# Altium project ALCT_MEZ_LX100.PrjPcb (part 5 of 8)

## Sheet GBTx_IO.SchDoc: GBTx I/O
size B; Organization: UCLA High Energy Physics; Address1: L3, 12a Rodborough Rd; Address2: Frenchs Forest; Address3: NSW; Address4: Australia 2086; DocumentNumber: 15; Revision: 2.0; SheetNumber: 15; SheetTotal: 23; CurrentDate: 9/6/2018; ModifiedDate: 9/6/2018; ProjectName: Project
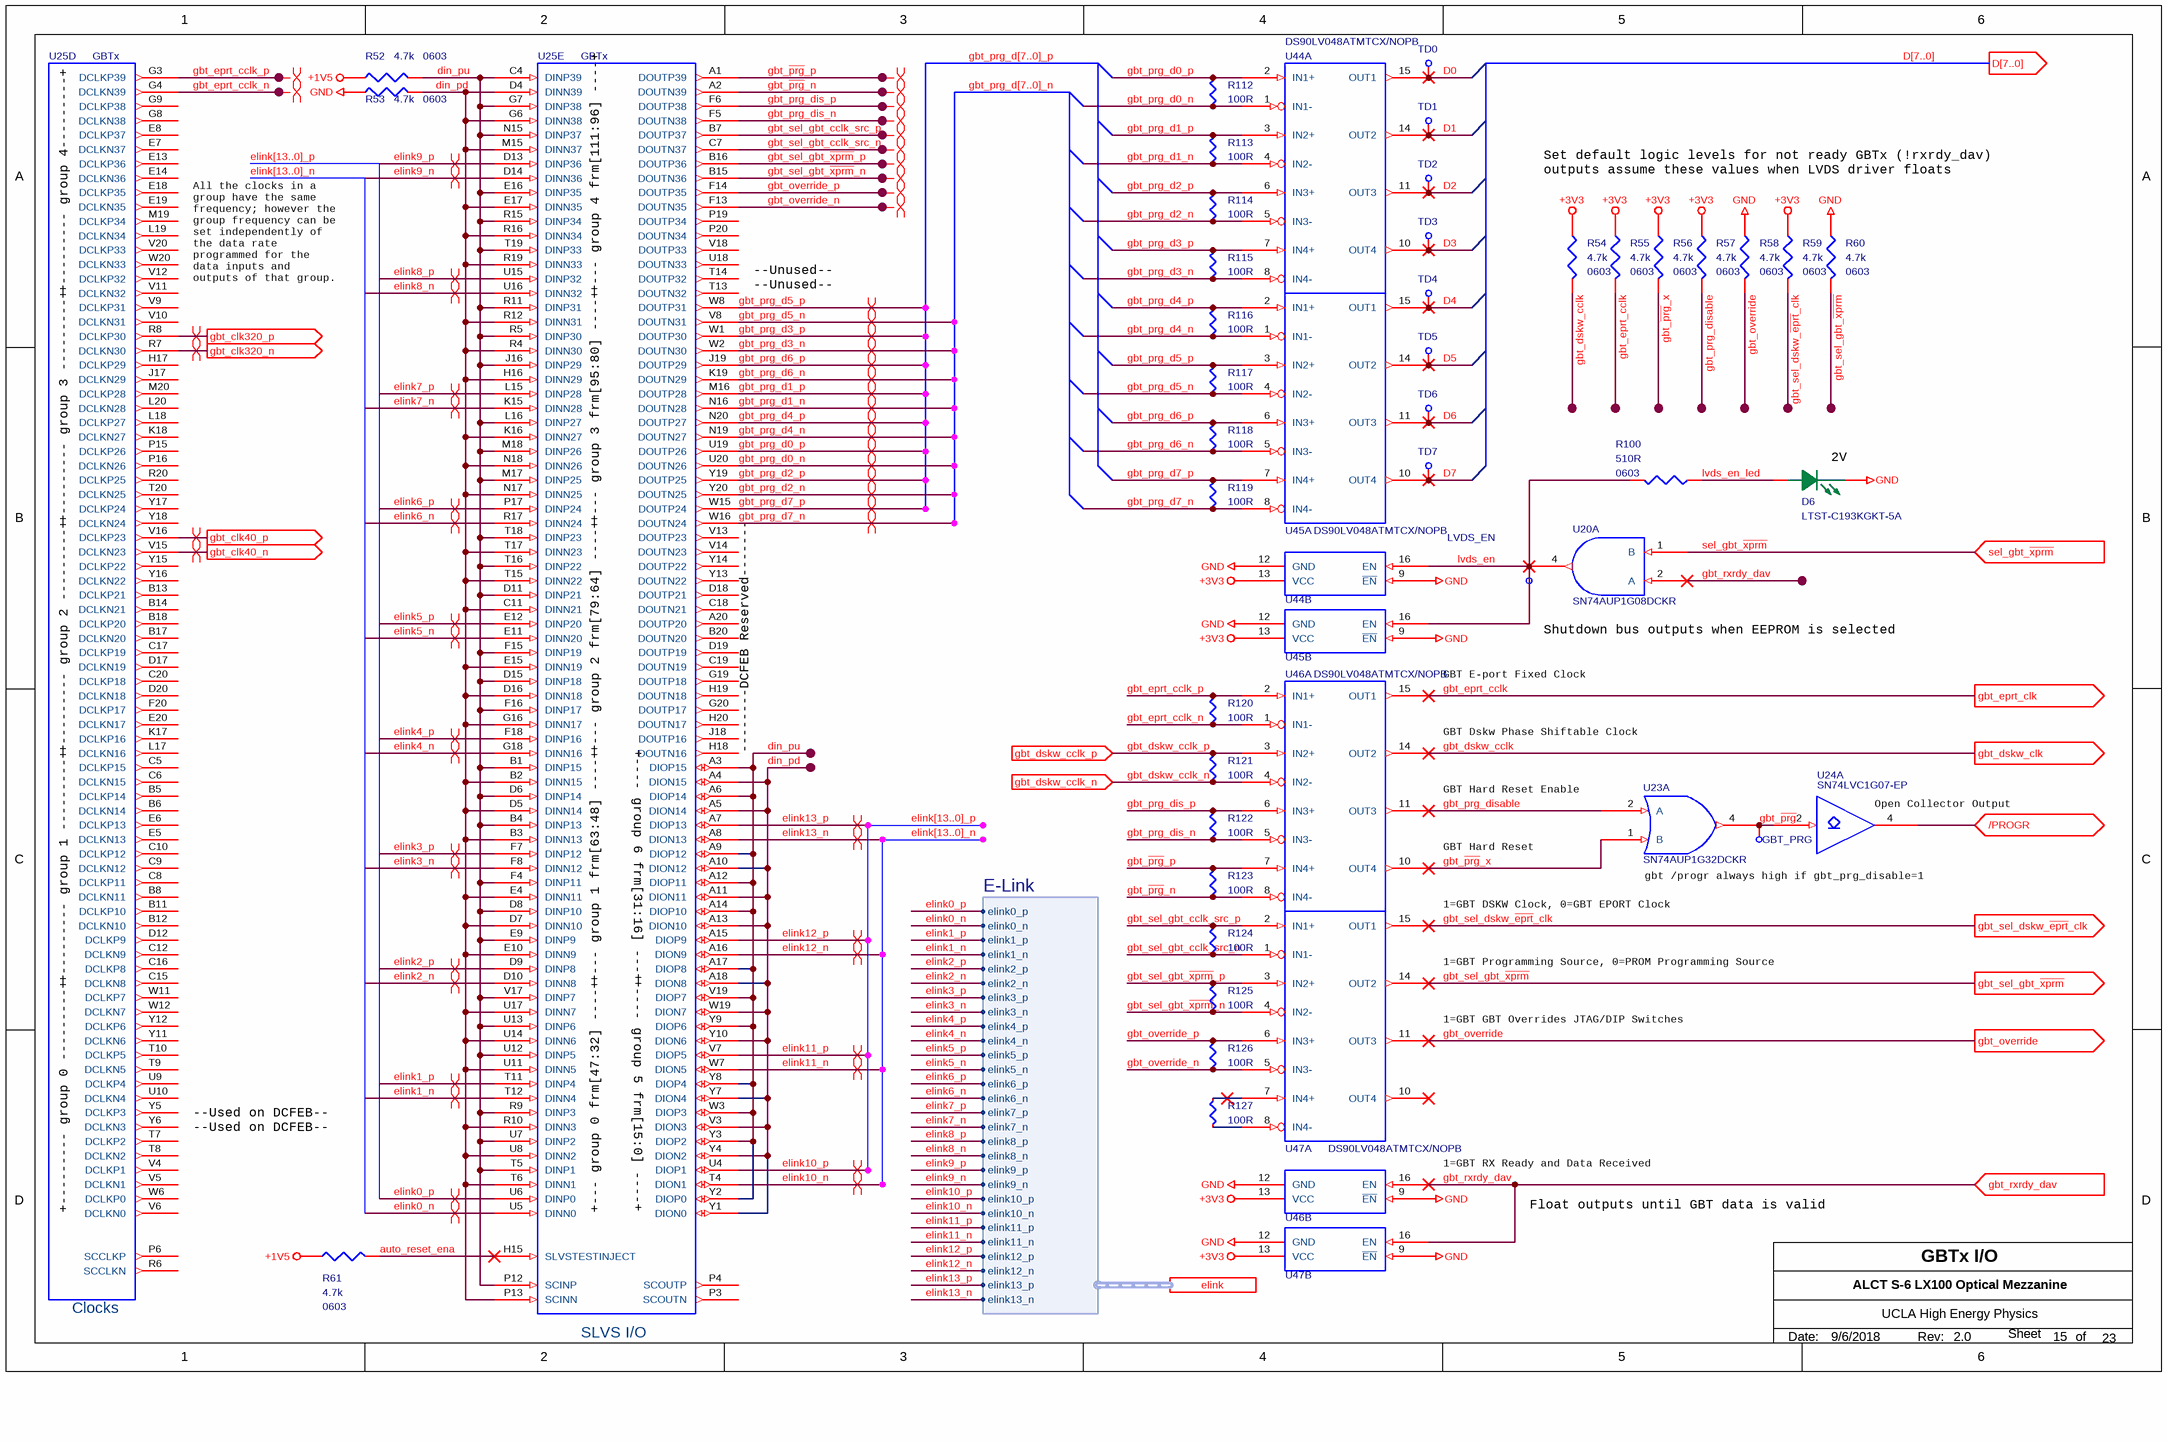
[diagram p19: GBTx_IO.SchDoc]

### Parts
D6  LTST-C193KGKT-5A  [MC_S6/SM/LED_0603]
GBT_PRG  Test Point Via  [MC_S6/TH/TPVIA]  (value not drawn)  (no BOM)
LVDS_EN  Test Point Via  [MC_S6/TH/TPVIA]  (value not drawn)  (no BOM)
R52  4.7k  Supplier Device Package: 0603  [MC_S6/SM/R_0603_IPC]
R53  4.7k  Supplier Device Package: 0603  [MC_S6/SM/R_0603_IPC]
R54  4.7k  Supplier Device Package: 0603  [MC_S6/SM/R_0603_IPC]
R55  4.7k  Supplier Device Package: 0603  [MC_S6/SM/R_0603_IPC]
R56  4.7k  Supplier Device Package: 0603  [MC_S6/SM/R_0603_IPC]
R57  4.7k  Supplier Device Package: 0603  [MC_S6/SM/R_0603_IPC]
R58  4.7k  Supplier Device Package: 0603  [MC_S6/SM/R_0603_IPC]
R59  4.7k  Supplier Device Package: 0603  [MC_S6/SM/R_0603_IPC]
R60  4.7k  Supplier Device Package: 0603  [MC_S6/SM/R_0603_IPC]
R61  4.7k  Supplier Device Package: 0603  [MC_S6/SM/R_0603_IPC]
R100  510R  Supplier Device Package: 0603  [MC_S6/SM/R_0603_IPC]
R112  100R  [MC_S6/SM/R_0402_IPC]
R113  100R  [MC_S6/SM/R_0402_IPC]
R114  100R  [MC_S6/SM/R_0402_IPC]
R115  100R  [MC_S6/SM/R_0402_IPC]
R116  100R  [MC_S6/SM/R_0402_IPC]
R117  100R  [MC_S6/SM/R_0402_IPC]
R118  100R  [MC_S6/SM/R_0402_IPC]
R119  100R  [MC_S6/SM/R_0402_IPC]
R120  100R  [MC_S6/SM/R_0402_IPC]
R121  100R  [MC_S6/SM/R_0402_IPC]
R122  100R  [MC_S6/SM/R_0402_IPC]
R123  100R  [MC_S6/SM/R_0402_IPC]
R124  100R  [MC_S6/SM/R_0402_IPC]
R125  100R  [MC_S6/SM/R_0402_IPC]
R126  100R  [MC_S6/SM/R_0402_IPC]
R127  100R  [MC_S6/SM/R_0402_IPC]
TD0  Test Point Via  [MC_S6/TH/TPVIA]  (value not drawn)  (no BOM)
TD1  Test Point Via  [MC_S6/TH/TPVIA]  (value not drawn)  (no BOM)
TD2  Test Point Via  [MC_S6/TH/TPVIA]  (value not drawn)  (no BOM)
TD3  Test Point Via  [MC_S6/TH/TPVIA]  (value not drawn)  (no BOM)
TD4  Test Point Via  [MC_S6/TH/TPVIA]  (value not drawn)  (no BOM)
TD5  Test Point Via  [MC_S6/TH/TPVIA]  (value not drawn)  (no BOM)
TD6  Test Point Via  [MC_S6/TH/TPVIA]  (value not drawn)  (no BOM)
TD7  Test Point Via  [MC_S6/TH/TPVIA]  (value not drawn)  (no BOM)
U20  SN74AUP1G08DCKR  [MC_S6/SM/SOT_SC70_DCK5]  (part A of 2)
U23  SN74AUP1G32DCKR  [MC_S6/SM/SOT_SC70_DCK5]  (part A of 2)
U24  SN74LVC1G07-EP  [SOT353-1]  (part A of 2)
U25  GBTx  [BGA400 GBT]  (parts D,E of 8)
U44  DS90LV048ATMTCX/NOPB  [MC_S6/SM/TSSOP16]  (parts A,B of 2)
U45  DS90LV048ATMTCX/NOPB  [MC_S6/SM/TSSOP16]  (parts A,B of 2)
U46  DS90LV048ATMTCX/NOPB  [MC_S6/SM/TSSOP16]  (parts A,B of 2)
U47  DS90LV048ATMTCX/NOPB  [MC_S6/SM/TSSOP16]  (parts A,B of 2)

### Ports
/PROGR (bidir), D[7..0] (out), elink (harness E-Link), gbt_clk40_n (out), gbt_clk40_p (out), gbt_clk320_n (out), gbt_clk320_p (out), gbt_dskw_cclk_n (in), gbt_dskw_cclk_p (in), gbt_dskw_clk (out), gbt_eprt_clk (out), gbt_override (out), gbt_rxrdy_dav (in), gbt_sel_dskw_~{eprt}_clk (out), gbt_sel_gbt_~{xprm} (out), sel_gbt_~{xprm} (in)

### Harnesses
E-Link: elink0_p, elink0_n, elink1_p, elink1_n, elink2_p, elink2_n, elink3_p, elink3_n, elink4_p, elink4_n, elink5_p, elink5_n, elink6_p, elink6_n, elink7_p, elink7_n, elink8_p, elink8_n, elink9_p, elink9_n, elink10_p, elink10_n, elink11_p, elink11_n, elink12_p, elink12_n, elink13_p, elink13_n

### Nets
+1V5: R52.1 R61.1
+3V3: R54.1 R55.1 R56.1 R57.1 R59.1 U44.13(VCC) U45.13(VCC) U46.13(VCC) U47.13(VCC)
GND: D6.K(CATHODE) R53.1 R58.1 R60.1 U44.9(~{EN}) U44.12(GND) U45.9(~{EN}) U45.12(GND) U46.9(~{EN}) U46.12(GND) U47.9(~{EN}) U47.12(GND)
/PROGR: U24.4(Y) ; port /PROGR
auto_reset_ena: R61.2 U25.H15(SLVSTESTINJECT)
D0: TD0.1(In) U44.15(OUT1)
D1: TD1.1(In) U44.14(OUT2)
D2: TD2.1(In) U44.11(OUT3)
D3: TD3.1(In) U44.10(OUT4)
D4: TD4.1(In) U45.15(OUT1)
D5: TD5.1(In) U45.14(OUT2)
D6: TD6.1(In) U45.11(OUT3)
D7: TD7.1(In) U45.10(OUT4)
din_pd: R53.2 U25.A4(DION15) U25.A5(DION14) U25.A10(DION12) U25.A11(DION11) U25.A13(DION10) U25.A18(DION8) U25.B2(DINN15) U25.B3(DINN13) U25.C11(DINN21) U25.D4(DINN39) U25.D5(DINN14) U25.D7(DINN10) U25.D16(DINN18) U25.E4(DINN11) U25.E10(DINN9) U25.E15(DINN19) U25.E17(DINN35) U25.G6(DINN38) U25.G16(DINN17) U25.H16(DINN29) U25.K16(DINN27) U25.M15(DINN37) U25.N17(DINN25) U25.N18(DINN26) U25.P13(SCINN) U25.R4(DINN30) U25.R10(DINN3) U25.R12(DINN31) U25.R16(DINN34) U25.R19(DINN33) U25.T6(DINN1) U25.T15(DINN22) U25.T17(DINN23) U25.U8(DINN2) U25.U11(DINN5) U25.U14(DINN6) U25.U17(DINN7) U25.V3(DION3) U25.W19(DION7) U25.Y1(DION0) U25.Y4(DION2) U25.Y7(DION4) U25.Y10(DION6)
din_pu: R52.2 U25.A3(DIOP15) U25.A6(DIOP14) U25.A9(DIOP12) U25.A12(DIOP11) U25.A14(DIOP10) U25.A17(DIOP8) U25.B1(DINP15) U25.B4(DINP13) U25.C4(DINP39) U25.D6(DINP14) U25.D8(DINP10) U25.D11(DINP21) U25.D15(DINP18) U25.E9(DINP9) U25.E16(DINP35) U25.F4(DINP11) U25.F15(DINP19) U25.F16(DINP17) U25.G7(DINP38) U25.J16(DINP29) U25.L16(DINP27) U25.M17(DINP25) U25.M18(DINP26) U25.N15(DINP37) U25.P12(SCINP) U25.R5(DINP30) U25.R9(DINP3) U25.R11(DINP31) U25.R15(DINP34) U25.T5(DINP1) U25.T16(DINP22) U25.T18(DINP23) U25.T19(DINP33) U25.U7(DINP2) U25.U12(DINP5) U25.U13(DINP6) U25.V17(DINP7) U25.V19(DIOP7) U25.W3(DIOP3) U25.Y2(DIOP0) U25.Y3(DIOP2) U25.Y8(DIOP4) U25.Y9(DIOP6)
elink0_n: U25.U5(DINN0) ; port elink.elink0_n
elink0_p: U25.U6(DINP0) ; port elink.elink0_p
elink1_n: U25.T12(DINN4) ; port elink.elink1_n
elink1_p: U25.T11(DINP4) ; port elink.elink1_p
elink2_n: U25.D10(DINN8) ; port elink.elink2_n
elink2_p: U25.D9(DINP8) ; port elink.elink2_p
elink3_n: U25.F8(DINN12) ; port elink.elink3_n
elink3_p: U25.F7(DINP12) ; port elink.elink3_p
elink4_n: U25.G18(DINN16) ; port elink.elink4_n
elink4_p: U25.F18(DINP16) ; port elink.elink4_p
elink5_n: U25.E11(DINN20) ; port elink.elink5_n
elink5_p: U25.E12(DINP20) ; port elink.elink5_p
elink6_n: U25.R17(DINN24) ; port elink.elink6_n
elink6_p: U25.P17(DINP24) ; port elink.elink6_p
elink7_n: U25.K15(DINN28) ; port elink.elink7_n
elink7_p: U25.L15(DINP28) ; port elink.elink7_p
elink8_n: U25.U16(DINN32) ; port elink.elink8_n
elink8_p: U25.U15(DINP32) ; port elink.elink8_p
elink9_n: U25.D14(DINN36) ; port elink.elink9_n
elink9_p: U25.D13(DINP36) ; port elink.elink9_p
elink10_n: U25.T4(DION1) ; port elink.elink10_n
elink10_p: U25.U4(DIOP1) ; port elink.elink10_p
elink11_n: U25.W7(DION5) ; port elink.elink11_n
elink11_p: U25.V7(DIOP5) ; port elink.elink11_p
elink12_n: U25.A16(DION9) ; port elink.elink12_n
elink12_p: U25.A15(DIOP9) ; port elink.elink12_p
elink13_n: U25.A8(DION13) ; port elink.elink13_n
elink13_p: U25.A7(DIOP13) ; port elink.elink13_p
gbt_clk40_n: U25.V15(DCLKN23) ; port gbt_clk40_n
gbt_clk40_p: U25.V16(DCLKP23) ; port gbt_clk40_p
gbt_clk320_n: U25.R7(DCLKN30) ; port gbt_clk320_n
gbt_clk320_p: U25.R8(DCLKP30) ; port gbt_clk320_p
gbt_dskw_cclk: R54.2 U46.14(OUT2) ; port gbt_dskw_clk
gbt_dskw_cclk_n: R121.2 U46.4(IN2-) ; port gbt_dskw_cclk_n
gbt_dskw_cclk_p: R121.1 U46.3(IN2+) ; port gbt_dskw_cclk_p
gbt_eprt_cclk: R55.2 U46.15(OUT1) ; port gbt_eprt_clk
gbt_eprt_cclk_n: R120.2 U25.G4(DCLKN39) U46.1(IN1-)
gbt_eprt_cclk_p: R120.1 U25.G3(DCLKP39) U46.2(IN1+)
gbt_override: R58.2 U47.11(OUT3) ; port gbt_override
gbt_override_n: R126.2 U25.F13(DOUTN35) U47.5(IN3-)
gbt_override_p: R126.1 U25.F14(DOUTP35) U47.6(IN3+)
gbt_~{prg}: GBT_PRG.1(In) U23.4(Y) U24.2(A)
gbt_~{prg}_n: R123.2 U25.A2(DOUTN39) U46.8(IN4-)
gbt_~{prg}_p: R123.1 U25.A1(DOUTP39) U46.7(IN4+)
gbt_~{prg}_x: R56.2 U23.1(B) U46.10(OUT4)
gbt_prg_d0_n: R112.2 U25.U20(DOUTN26) U44.1(IN1-)
gbt_prg_d0_p: R112.1 U25.U19(DOUTP26) U44.2(IN1+)
gbt_prg_d1_n: R113.2 U25.N16(DOUTN28) U44.4(IN2-)
gbt_prg_d1_p: R113.1 U25.M16(DOUTP28) U44.3(IN2+)
gbt_prg_d2_n: R114.2 U25.Y20(DOUTN25) U44.5(IN3-)
gbt_prg_d2_p: R114.1 U25.Y19(DOUTP25) U44.6(IN3+)
gbt_prg_d3_n: R115.2 U25.W2(DOUTN30) U44.8(IN4-)
gbt_prg_d3_p: R115.1 U25.W1(DOUTP30) U44.7(IN4+)
gbt_prg_d4_n: R116.2 U25.N19(DOUTN27) U45.1(IN1-)
gbt_prg_d4_p: R116.1 U25.N20(DOUTP27) U45.2(IN1+)
gbt_prg_d5_n: R117.2 U25.V8(DOUTN31) U45.4(IN2-)
gbt_prg_d5_p: R117.1 U25.W8(DOUTP31) U45.3(IN2+)
gbt_prg_d6_n: R118.2 U25.K19(DOUTN29) U45.5(IN3-)
gbt_prg_d6_p: R118.1 U25.J19(DOUTP29) U45.6(IN3+)
gbt_prg_d7_n: R119.2 U25.W16(DOUTN24) U45.8(IN4-)
gbt_prg_d7_p: R119.1 U25.W15(DOUTP24) U45.7(IN4+)
gbt_prg_dis_n: R122.2 U25.F5(DOUTN38) U46.5(IN3-)
gbt_prg_dis_p: R122.1 U25.F6(DOUTP38) U46.6(IN3+)
gbt_prg_disable: R57.2 U23.2(A) U46.11(OUT3)
gbt_rxrdy_dav: U20.2(A) U46.16(EN) U47.16(EN) ; port gbt_rxrdy_dav
gbt_sel_dskw_~{eprt}_clk: R59.2 U47.15(OUT1) ; port gbt_sel_dskw_~{eprt}_clk
gbt_sel_gbt_cclk_src_n: R124.2 U25.C7(DOUTN37) U47.1(IN1-)
gbt_sel_gbt_cclk_src_p: R124.1 U25.B7(DOUTP37) U47.2(IN1+)
gbt_sel_gbt_~{xprm}: R60.2 U47.14(OUT2) ; port gbt_sel_gbt_~{xprm}
gbt_sel_gbt_~{xprm}_n: R125.2 U25.B15(DOUTN36) U47.4(IN2-)
gbt_sel_gbt_~{xprm}_p: R125.1 U25.B16(DOUTP36) U47.3(IN2+)
lvds_en: LVDS_EN.1(In) R100.2 U20.4(Y) U44.16(EN) U45.16(EN)
lvds_en_led: D6.A(ANODE) R100.1
sel_gbt_~{xprm}: U20.1(B) ; port sel_gbt_~{xprm}
NetR127_1: R127.1 U47.7(IN4+)
NetR127_2: R127.2 U47.8(IN4-)

Not connected (* = marked no-connect by the designer): U25 A20(DOUTP20) B5(DCLKP14) B6(DCLKN14) B8(DCLKN11) B11(DCLKP10) B12(DCLKN10) B13(DCLKP21) B14(DCLKN21) B17(DCLKN20) B18(DCLKP20) B20(DOUTN20) C5(DCLKP15) C6(DCLKN15) C8(DCLKP11) C9(DCLKN12) C10(DCLKP12) C12(DCLKN9) C15(DCLKN8) C16(DCLKP8) C17(DCLKP19) C18(DOUTN21) C19(DOUTN19) C20(DCLKP18) D12(DCLKP9) D17(DCLKN19) D18(DOUTP21) D19(DOUTP19) D20(DCLKN18) E5(DCLKN13) E6(DCLKP13) E7(DCLKN37) E8(DCLKP37) E13(DCLKP36) E14(DCLKN36) E18(DCLKP35) E19(DCLKN35) E20(DCLKN17) F20(DCLKP17) G8(DCLKN38) G9(DCLKP38) G19(DOUTP18) G20(DOUTP17) H17(DCLKP29) H18(DOUTN16) H19(DOUTN18) H20(DOUTN17) J17(DCLKN29) J18(DOUTP16) K17(DCLKP16) K18(DCLKN27) L17(DCLKN16) L18(DCLKP27) L19(DCLKN34) L20(DCLKN28) M19(DCLKP34) M20(DCLKP28) P3(SCOUTN) P4(SCOUTP) P6(SCCLKP) P15(DCLKP26) P16(DCLKN26) P19(DOUTP34) P20(DOUTN34) R6(SCCLKN) R20(DCLKP25) T7(DCLKP2) T8(DCLKN2) T9(DCLKN5) T10(DCLKP5) T13(DOUTN32) T14(DOUTP32) T20(DCLKN25) U9(DCLKP4) U10(DCLKN4) U18(DOUTN33) V4(DCLKP1) V5(DCLKN1) V6(DCLKN0) V9(DCLKP31) V10(DCLKN31) V11(DCLKN32) V12(DCLKP32) V13(DOUTP23) V14(DOUTN23) V18(DOUTP33) V20(DCLKP33) W6(DCLKP0) W11(DCLKP7) W12(DCLKN7) W20(DCLKN33) Y5(DCLKP3) Y6(DCLKN3) Y11(DCLKN6) Y12(DCLKP6) Y13(DOUTN22) Y14(DOUTP22) Y15(DCLKP22) Y16(DCLKN22) Y17(DCLKP24) Y18(DCLKN24); U47 10(OUT4)*

### Buses and harness runs
bus D[7..0] = port D[7..0]
bus elink[13..0]_n
bus elink[13..0]_p
bus gbt_prg_d[7..0]_n
bus gbt_prg_d[7..0]_p

### Layout directives
differential pair: elink0_n, elink0_p, elink1_n, elink1_p, elink2_n, elink2_p, elink3_n, elink3_p, elink4_n, elink4_p, elink5_n, elink5_p, elink6_n, elink6_p, elink7_n, elink7_p, elink8_n, elink8_p, elink9_n, elink9_p, elink10_n, elink10_p, elink11_n, elink11_p, elink12_n, elink12_p, elink13_n, elink13_p, gbt_clk40_n, gbt_clk40_p, gbt_clk320_n, gbt_clk320_p, gbt_eprt_cclk_n, gbt_eprt_cclk_p, gbt_override_n, gbt_override_p, gbt_prg_d0_n, gbt_prg_d0_p, gbt_prg_d1_n, gbt_prg_d1_p, gbt_prg_d2_n, gbt_prg_d2_p, gbt_prg_d3_n, gbt_prg_d3_p, gbt_prg_d4_n, gbt_prg_d4_p, gbt_prg_d5_n, gbt_prg_d5_p, gbt_prg_d6_n, gbt_prg_d6_p, gbt_prg_d7_n, gbt_prg_d7_p, gbt_prg_dis_n, gbt_prg_dis_p, gbt_sel_gbt_cclk_src_n, gbt_sel_gbt_cclk_src_p, gbt_sel_gbt_~{xprm}_n, gbt_sel_gbt_~{xprm}_p, gbt_~{prg}_n, gbt_~{prg}_p

### Notes on the sheet
- Set default logic levels for not ready GBTx (!rxrdy_dav)
- outputs assume these values when LVDS driver floats
- +--------- group 4---------+
- All the clocks in a group have the same frequency; however the group frequency can be set independently of the data rate programmed for the data inputs and outputs of that group.
- (near U25) +--- group 4 frm[111:96] ----+
- --Unused--
- (near D6) 2V
- +--------- group 3 ---------+
- (near U25) +--- group 3 frm[95:80] ----+
- GBT E-port Fixed Clock
- Shutdown bus outputs when EEPROM is selected
- +--------- group 2 ---------+
- (near U25) +--- group 2 frm[79:64] ----+
- (near U25) --------DCFEB Reserved-------
- GBT Dskw Phase Shiftable Clock
- GBT Hard Reset Enable
- (near U24) Open Collector Output
- GBT Hard Reset
- gbt /progr always high if gbt_prg_disable=1
- 1=GBT DSKW Clock, 0=GBT EPORT Clock
- 1=GBT Programming Source, 0=PROM Programming Source
- +--------- group 1 ---------+
- (near U25) +--- group 1 frm[63:48] ----+
- (near U25) +---- group 6 frm[31:16] ---+
- 1=GBT GBT Overrides JTAG/DIP Switches
- --Used on DCFEB--
- 1=GBT RX Ready and Data Received
- +--------- group 0 ---------+
- (near U25) +--- group 0 frm[47:32] ----+
- (near U25) +---- group 5 frm[15:0] ----+
- Float outputs until GBT data is valid
- Date:
- Rev:
- of
- Sheet
- (in symbol GBTx, part D) Clocks
- (in symbol GBTx, part E) SLVS I/O

### Library data of the parts
D6 = LTST-C193KGKT-5A: LED GREEN CLEAR 0603 SMD; Manufacturer: Lite-On Inc.; Current - Test: 5mA; Lens Color: Colorless; Lens Style/Size: Rectangle with Flat Top, 1.15mm x 0.80mm; Millicandela Rating: 16.25mcd; Viewing Angle: 130°; Voltage - Forward (Vf) (Typ): 2V; Wavelength - Dominant: 572nm; Wavelength - Peak: 574nm; Category: Optoelectronics; Color: Green; ComponentLink1Description: http://optoelectronics.liteon.com/upload/download/DS22-2007-0094/LTST-C193KGKT-5A.PDF; ComponentLink1URL: http://optoelectronics.liteon.com/upload/download/DS22-2007-0094/LTST-C193KGKT-5A.PDF; Features: -; Height (Max): 0.45mm; Lens Transparency: Clear; Manufacturer Part Number: LTST-C193KGKT-5A; Mounting Type: Surface Mount; Package / Case: 0603 (1608 Metric); Packaging: Cut Tape (CT); Part Status: Active; Pricing 1: 1=0.41, 10=0.296, 25=0.2268, 100=0.148, 250=0.10852, 500=0.0921, 1000=0.07565, 2500=0.06578 (USD); Pricing 2: 1=0.41, 10=0.296, 25=0.2268, 100=0.148, 250=0.10852, 500=0.0921, 1000=0.07565, 2500=0.06578 (USD); RoHS: RoHS Compliant; Size / Dimension: 1.60mm L x 0.80mm W; Stock 1: 83440; Stock 2: 83440; Supplier 1: Digi-Key; Supplier 2: Digi-Key; Supplier Device Package: Chip LED; Supplier Part Number 1: 160-1828-1-ND; Supplier Part Number 2: 160-1828-6-ND
GBT_PRG LVDS_EN TD0-TD7 = TPVIA: COMPSIDE: TOP; COMPGROUP: 0; mfgr: Layout; COMPROT: 0; Package: 90; mfgr_id: TPVIA; mfgr_foot: TPVIA
R52-R61 = CR0603-FX-4701ELF: as R44-R50 on sheet Source_Select; Supplier 1: Digi-Key; Manufacturer Part Number: CR0603-FX-4701ELF; RoHS: RoHS Compliant; Category: Resistors; Stock 1: 43560; Pricing 1: 1=0.1, 10=0.021, 100=0.0086, 1000=0.00385, 2500=0.00334 (USD); Packaging: Cut Tape (CT); Part Status: Active; Resistance (Ohms): 4.7k; Tolerance: ±1%; Composition: Thick Film; Features: Moisture Resistant; Operating Temperature: -55°C ~ 155°C; Package / Case: 0603 (1608 Metric); Size / Dimension: 0.063" L x 0.031" W (1.60mm x 0.80mm); Height - Seated (Max): 0.022" (0.55mm); Failure Rate: -; ComponentLink1URL: http://www.bourns.com/docs/Product-Datasheets/CHPREZTR.pdf; ComponentLink1Description: http://www.bourns.com/docs/Product-Datasheets/CHPREZTR.pdf; Supplier 2: Digi-Key; Stock 2: 43560; Pricing 2: 1=0.1, 10=0.021, 100=0.0086, 1000=0.00385, 2500=0.00334 (USD); Supplier Part Number 1: CR0603-FX-4701ELFCT-ND; Supplier Part Number 2: CR0603-FX-4701ELFDKR-ND
R100 = CR0603-FX-5100ELF: RES SMD 510 OHM 1% 1/10W 0603; Manufacturer: Bourns Inc.; Power (Watts): 0.1W, 1/10W; Temperature Coefficient: ±100ppm/°C; Tolerance: ±1%; Supplier 1: Digi-Key; Manufacturer Part Number: CR0603-FX-5100ELF; RoHS: RoHS Compliant; Category: Resistors; Stock 1: 523; Pricing 1: 1=0.1, 10=0.021, 100=0.0086, 1000=0.00385, 2500=0.00334 (USD); Packaging: Digi-Reel®; Part Status: Active; Composition: Thick Film; Features: Moisture Resistant; Operating Temperature: -55°C ~ 155°C; Package / Case: 0603 (1608 Metric); Size / Dimension: 0.063" L x 0.032" W (1.60mm x 0.80mm); Height - Seated (Max): 0.022" (0.55mm); Failure Rate: -; ComponentLink1URL: https://www.bourns.com/docs/Product-Datasheets/CHPREZTR.pdf; ComponentLink1Description: https://www.bourns.com/docs/Product-Datasheets/CHPREZTR.pdf; Supplier Part Number 1: CR0603-FX-5100ELFDKR-ND
R112-R127 = RMCF0402FT100R_SHORTSYM: RES SMD 100 OHM 1% 1/16W 0402; Manufacturer: Stackpole Electronics Inc.; Power (Watts): 0.063W, 1/16W; Temperature Coefficient: ±100ppm/°C; Supplier 1: Digi-Key; Manufacturer Part Number: RMCF0402FT100R; RoHS: RoHS Compliant; Category: Resistors; Stock 1: 263860; Pricing 1: 1=0.1, 10=0.017, 100=0.0068, 1000=0.00306, 2500=0.00266, 5000=0.00219 (USD); Packaging: Digi-Reel®; Part Status: Active; Tolerance: ±1%; Composition: Thick Film; Features: Automotive AEC-Q200; Operating Temperature: -55°C ~ 155°C; Package / Case: 0402 (1005 Metric); Supplier Device Package: 0402; Size / Dimension: 0.039" L x 0.020" W (1.00mm x 0.50mm); Height - Seated (Max): 0.016" (0.40mm); Failure Rate: -; ComponentLink1URL: https://www.seielect.com/Catalog/SEI-RMCF_RMCP.pdf; ComponentLink1Description: https://www.seielect.com/Catalog/SEI-RMCF_RMCP.pdf; Supplier Part Number 1: RMCF0402FT100RDKR-ND
U20 = SN74AUP1G08DCKR: IC GATE AND 1CH 2-INP 5-TSSOP; Manufacturer: Texas Instruments; Manufacturer Part Number: SN74AUP1G08DCKT; Logic Type: AND Gate; Number of Inputs: 2; Voltage - Supply: 0.8 V ~ 3.6 V; Current - Output High, Low: 4mA, 4mA; Logic Level - Low: 0.7 V ~ 0.9 V; Logic Level - High: 1.6 V ~ 2 V; Max Propagation Delay @ V, Max CL: 6.2ns @ 3.3V, 30pF; Supplier 1: Digi-Key; RoHS: RoHS Compliant; Category: Integrated Circuits (ICs); Stock 1: 7470; Pricing 1: 1=0.8, 10=0.707, 100=0.542 (USD); Packaging: Cut Tape (CT); Part Status: Active; Features: -; Operating Temperature: -40°C ~ 85°C; Mounting Type: Surface Mount; Supplier Device Package: SC-70-5; Package / Case: 5-TSSOP, SC-70-5, SOT-353; ComponentLink1URL: http://www.ti.com/lit/ds/symlink/sn74aup1g08.pdf; ComponentLink1Description: http://www.ti.com/lit/ds/symlink/sn74aup1g08.pdf; Supplier 2: Digi-Key; Stock 2: 7470; Pricing 2: 1=0.8, 10=0.707, 100=0.542 (USD); Supplier Part Number 1: 296-32258-1-ND; Supplier Part Number 2: 296-32258-6-ND
U23 = SN74AUP1G32DCKR: IC GATE OR 1CH 2-INP 5-TSSOP; Manufacturer: Texas Instruments; Manufacturer Part Number: SN74AUP1G32DCKT; Logic Type: OR Gate; Number of Inputs: 2; Voltage - Supply: 0.8 V ~ 3.6 V; Current - Output High, Low: 4mA, 4mA; Logic Level - Low: 0.7 V ~ 0.9 V; Logic Level - High: 1.6 V ~ 2 V; Max Propagation Delay @ V, Max CL: 6.4ns @ 3.3V, 30pF; Supplier 1: Digi-Key; RoHS: RoHS Compliant; Category: Integrated Circuits (ICs); Stock 1: 96; Pricing 1: 1=0.8, 10=0.707, 100=0.542 (USD); Packaging: Cut Tape (CT); Part Status: Active; Features: -; Operating Temperature: -40°C ~ 85°C; Mounting Type: Surface Mount; Supplier Device Package: SC-70-5; Package / Case: 5-TSSOP, SC-70-5, SOT-353; ComponentLink1URL: http://www.ti.com/lit/ds/symlink/sn74aup1g32.pdf; ComponentLink1Description: http://www.ti.com/lit/ds/symlink/sn74aup1g32.pdf; Supplier 2: Digi-Key; Stock 2: 96; Pricing 2: 1=0.8, 10=0.707, 100=0.542 (USD); Supplier Part Number 1: 296-32262-1-ND; Supplier Part Number 2: 296-32262-6-ND
U24 = SN74LVC1G07-EP: IC BUFF/DVR NON-INVERT Open Drain SC70-5; Manufacturer: Texas Instruments; mfgr_id: SN74LVC1G07MDCKREP; mfgr: Texas Inst; mfgr_foot: DCK; COMPROT: 270; COMPGROUP: 0; COMPSIDE: TOP; Logic Type: Buffer, Non-Inverting; Number of Bits per Element: 1; Current - Output High, Low: -, 32mA; Voltage - Supply: 1.65 V ~ 5.5 V; Package: 99; Supplier 1: Digi-Key; Manufacturer Part Number: SN74LVC1G07MDCKREP; RoHS: RoHS Compliant; Category: Integrated Circuits (ICs); Stock 1: 4252; Pricing 1: 1=0.81, 10=0.714, 100=0.5472, 500=0.4326, 1000=0.34608 (USD); Packaging: Cut Tape (CT); Part Status: Active; Input Type: -; Output Type: Open Drain; Operating Temperature: -55°C ~ 125°C (TA); Mounting Type: Surface Mount; Package / Case: 5-TSSOP, SC-70-5, SOT-353; Supplier Device Package: SC-70-5; ComponentLink1URL: http://www.ti.com/lit/ds/symlink/sn74lvc1g07-ep.pdf; ComponentLink1Description: http://www.ti.com/lit/ds/symlink/sn74lvc1g07-ep.pdf; Supplier 2: Digi-Key; Stock 2: 4252; Pricing 2: 1=0.81, 10=0.714, 100=0.5472, 500=0.4326, 1000=0.34608 (USD); Supplier Part Number 1: 296-22343-1-ND; Supplier Part Number 2: 296-22343-6-ND
U44-U47 = DS90LV048ATMCX_LARGE: IC LINE RECEIVER 3V QUAD DIFF 16TSSOP; Manufacturer: TI National Semiconductor; Operating Supply Voltage: 3.3V; Propagation Delay: 2.7ns; Number of Elements: 4; Max Power Dissipation: 866mW; Max Supply Voltage: 3.6V; Data Rate: 400Mbps; Operating Supply Current: 15mA; Max Supply Current: 9mA; Power Consumption: 30W; Max Input Voltage: 0uV; Min Input Voltage: -100mV; Supplier 1: Digi-Key; Manufacturer Part Number: DS90LV048ATMTCX/NOPB; Stock 1: 55591; Pricing 1: 1=2.91, 10=2.618, 100=2.104, 500=1.7286, 1000=1.43227 (USD); Mount: Surface Mount; Case/Package: TSSOP; Number of Pins: 16; Weight: 0.002222oz; Min Operating Temperature: -40°C; Max Operating Temperature: 85°C; Packaging: Tape and Reel; Number of Receivers: 4; Package Quantity: 2500; Min Supply Voltage: 3V; Number of Drivers: 4; Turn-On Delay Time: 2.7ns; Power Dissipation: 866mW; Number of Channels: 4; Logic Function: Receiver; Length: 5mm; Height: 0.9mm; Width: 4.4mm; Radiation Hardening: No; REACH SVHC: No SVHC; Lead Free: Lead Free; ComponentLink1URL: https://datasheet.ciiva.com/6635/ds90lv048a-6635703.pdf; ComponentLink1Description: https://datasheet.ciiva.com/6635/ds90lv048a-6635703.pdf; ComponentLink2URL: https://datasheet.ciiva.com/26001/ds90lv048a-26001784.pdf; ComponentLink2Description: https://datasheet.ciiva.com/26001/ds90lv048a-26001784.pdf; ComponentLink3URL: https://datasheet.ciiva.com/15133/getdatasheetpartid-647745-15133146.pdf; ComponentLink3Description: https://datasheet.ciiva.com/15133/getdatasheetpartid-647745-15133146.pdf; ComponentLink4URL: https://datasheet.ciiva.com/3151/ds90lv048a-3151499.pdf; ComponentLink4Description: https://datasheet.ciiva.com/3151/ds90lv048a-3151499.pdf; Supplier Part Number 1: DS90LV048ATMTCX/NOPBDKR-ND

## Sheet FPGA_Configuration.SchDoc: Configuration Logic
size B; Organization: UCLA High Energy Physics; DocumentNumber: 12; Revision: 2.0; SheetNumber: 12; SheetTotal: 23; CurrentDate: 9/6/2018; ModifiedDate: 9/6/2018
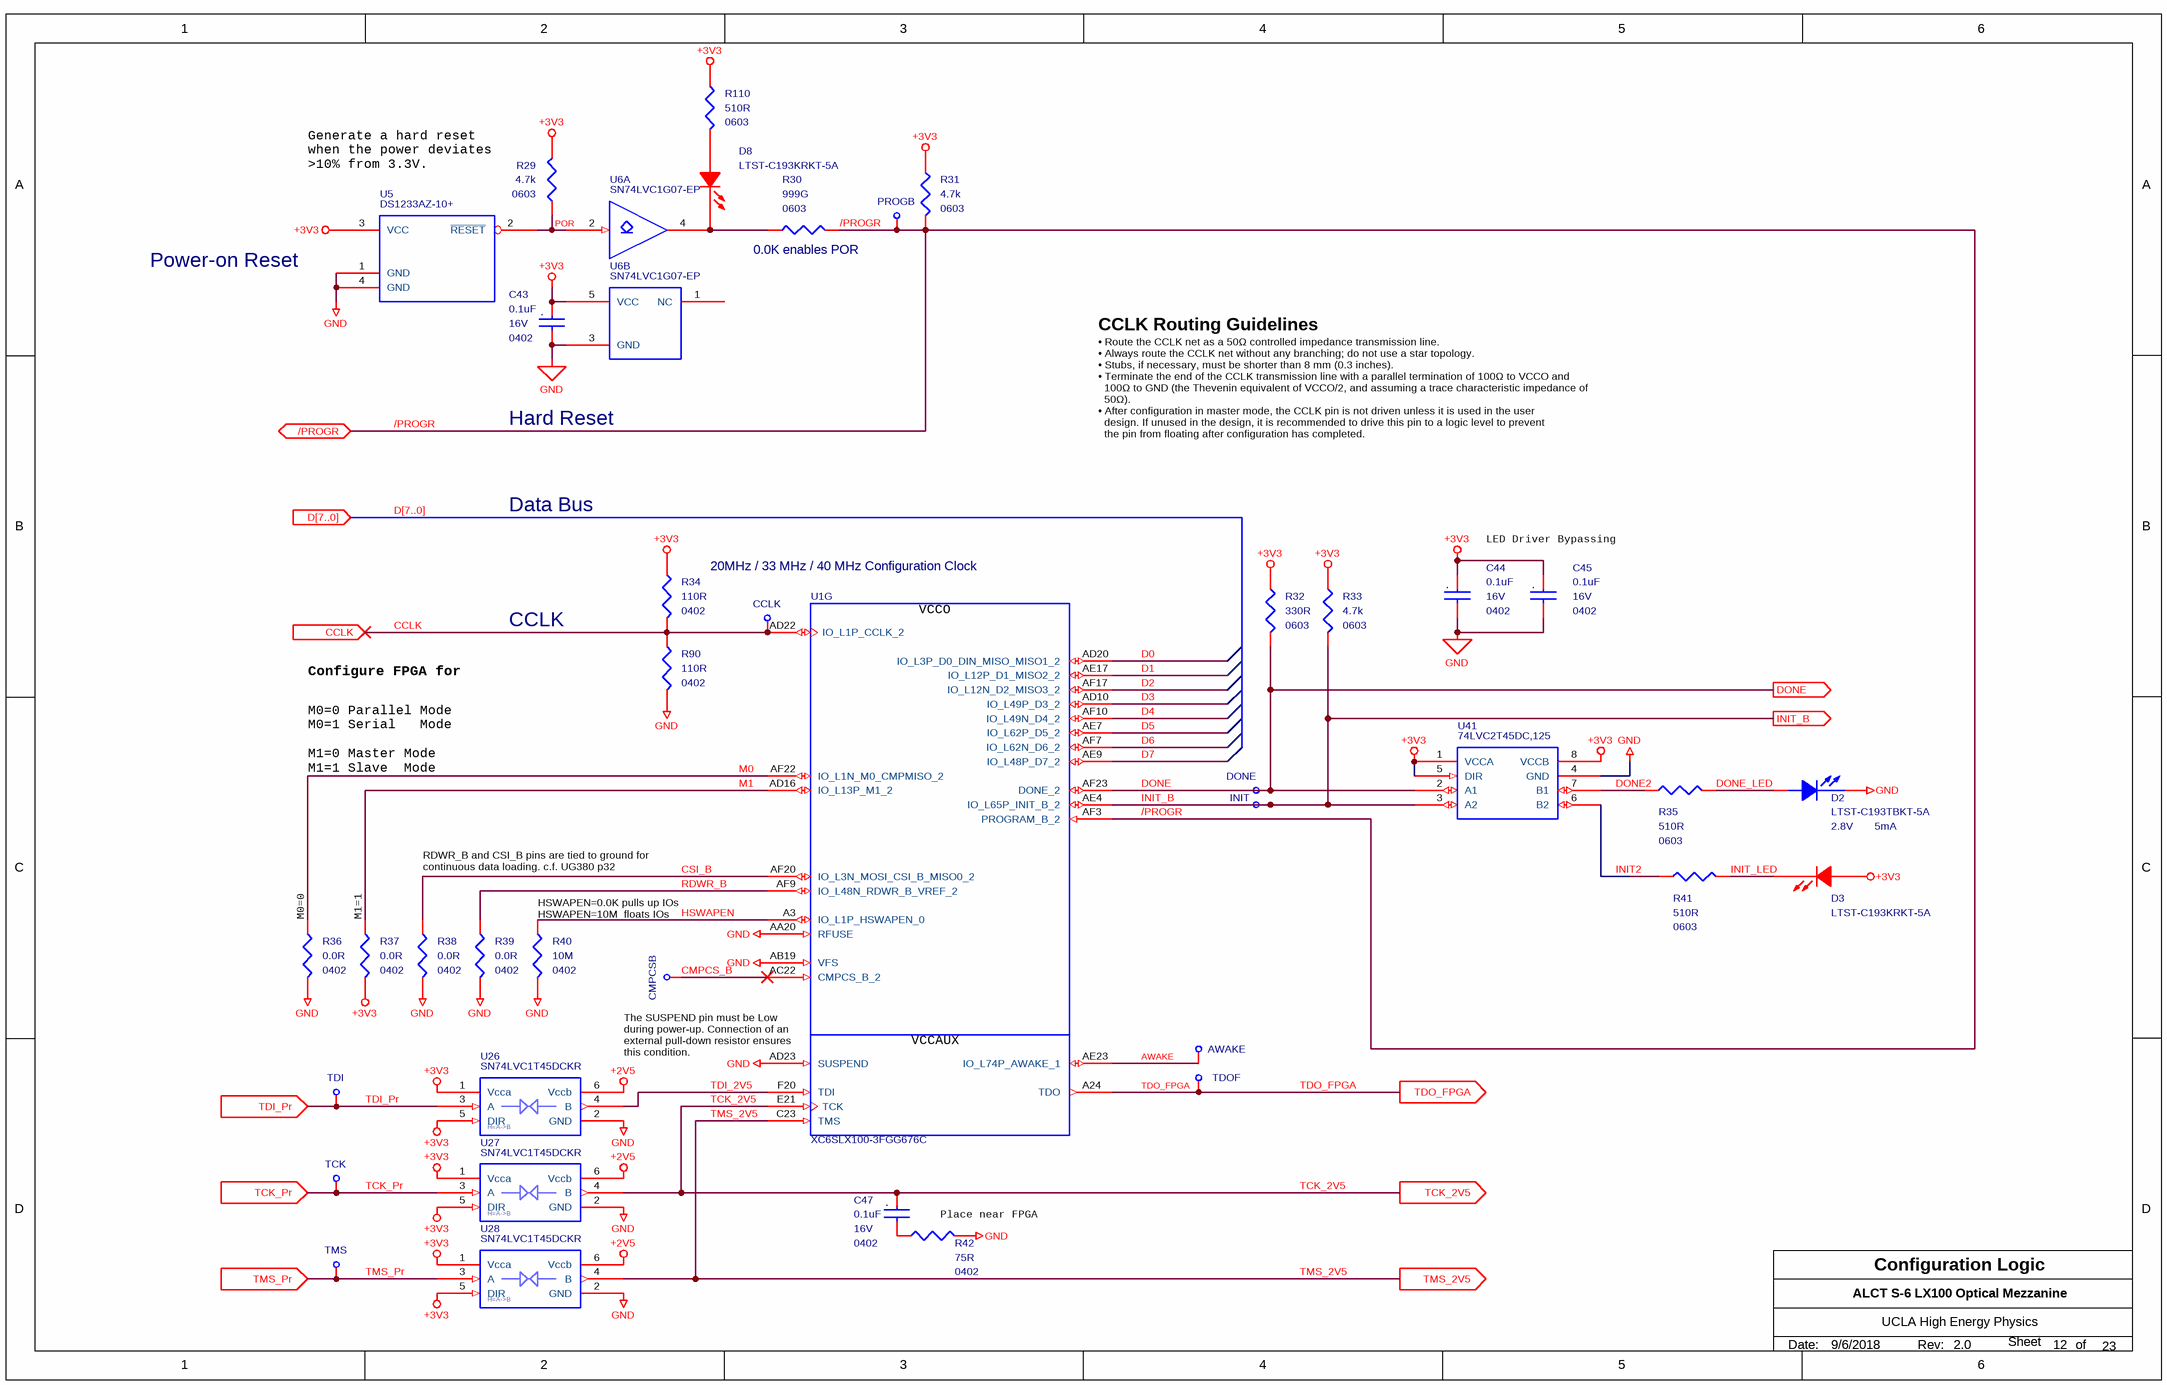
[diagram p20: FPGA_Configuration.SchDoc]

### Parts
AWAKE  Test Point Via  [MC_S6/TH/TPVIA]  (value not drawn)  (no BOM)
C43  0.1uF  package: 0402  Voltage - Rated: 16V  [MC_S6/SM/C_0402_IPC]
C44  0.1uF  package: 0402  Voltage - Rated: 16V  [MC_S6/SM/C_0402_IPC]
C45  0.1uF  package: 0402  Voltage - Rated: 16V  [MC_S6/SM/C_0402_IPC]
C47  0.1uF  package: 0402  Voltage - Rated: 16V  [MC_S6/SM/C_0402_IPC]
CCLK  Test Point Via  [MC_S6/TH/TPVIA]  (value not drawn)  (no BOM)
CMPCSB  Test Point Via  [MC_S6/TH/TPVIA]  (value not drawn)  (no BOM)
D2  LTST-C193TBKT-5A  Voltage - Forward (Vf) (Typ): 2.8V  Current - Test: 5mA  [MC_S6/SM/LED_0603]
D3  LTST-C193KRKT-5A  [MC_S6/SM/LED_0603]
D8  LTST-C193KRKT-5A  [MC_S6/SM/LED_0603]
DONE  Test Point Via  [MC_S6/TH/TPVIA]  (value not drawn)  (no BOM)
INIT  Test Point Via  [MC_S6/TH/TPVIA]  (value not drawn)  (no BOM)
PROGB  Test Point Via  [MC_S6/TH/TPVIA]  (value not drawn)  (no BOM)
R29  4.7k  Supplier Device Package: 0603  [MC_S6/SM/R_0603_IPC]
R30  999G  Supplier Device Package: 0603  [MC_S6/SM/R_0603_IPC]  (no BOM)
R31  4.7k  Supplier Device Package: 0603  [MC_S6/SM/R_0603_IPC]
R32  330R  Supplier Device Package: 0603  [MC_S6/SM/R_0603_IPC]
R33  4.7k  Supplier Device Package: 0603  [MC_S6/SM/R_0603_IPC]
R34  110R  Supplier Device Package: 0402  [MC_S6/SM/R_0402_IPC]
R35  510R  Supplier Device Package: 0603  [MC_S6/SM/R_0603_IPC]
R36  0.0R  Supplier Device Package: 0402  [MC_S6/SM/R_0402_IPC]
R37  0.0R  Supplier Device Package: 0402  [MC_S6/SM/R_0402_IPC]
R38  0.0R  Supplier Device Package: 0402  [MC_S6/SM/R_0402_IPC]
R39  0.0R  Supplier Device Package: 0402  [MC_S6/SM/R_0402_IPC]
R40  10M  Supplier Device Package: 0402  [MC_S6/SM/R_0402_IPC]
R41  510R  Supplier Device Package: 0603  [MC_S6/SM/R_0603_IPC]
R42  75R  Supplier Device Package: 0402  [MC_S6/SM/R_0402_IPC]
R90  110R  Supplier Device Package: 0402  [MC_S6/SM/R_0402_IPC]
R110  510R  Supplier Device Package: 0603  [MC_S6/SM/R_0603_IPC]
TCK  Test Point Via  [MC_S6/TH/TPVIA]  (value not drawn)  (no BOM)
TDI  Test Point Via  [MC_S6/TH/TPVIA]  (value not drawn)  (no BOM)
TDOF  Test Point Via  [MC_S6/TH/TPVIA]  (value not drawn)  (no BOM)
TMS  Test Point Via  [MC_S6/TH/TPVIA]  (value not drawn)  (no BOM)
U1  XC6SLX100-3FGG676C  [FGG676]  (part G of 10)
U5  DS1233AZ-10+  [MC_S6/SM/SOT223_1243]
U6  SN74LVC1G07-EP  [SOT353-1]  (parts A,B of 2)
U26  SN74LVC1T45DCKR  [MC_S6/SM/SOT_SC70_DCK6]
U27  SN74LVC1T45DCKR  [MC_S6/SM/SOT_SC70_DCK6]
U28  SN74LVC1T45DCKR  [MC_S6/SM/SOT_SC70_DCK6]
U41  74LVC2T45DC,125  [VSSOP8 SOT765-1]

### Ports
/PROGR (bidir), CCLK (in), D[7..0] (in), DONE (out), INIT_B (out), TCK_2V5 (out), TCK_Pr (in), TDI_Pr (in), TDO_FPGA (out), TMS_2V5 (out), TMS_Pr (in)

### Nets
+2V5: U26.6(Vccb) U27.6(Vccb) U28.6(Vccb)
+3V3: C43.1 C44.1 C45.1 D3.A(ANODE) R29.1 R31.1 R32.1 R33.1 R34.1 R37.2 R110.1 U5.3(VCC) U6.5(VCC) U26.1(Vcca) U26.5(DIR) U27.1(Vcca) U27.5(DIR) U28.1(Vcca) U28.5(DIR) U41.1(VCCA) U41.5(DIR) U41.8(VCCB)
GND: C43.2 C44.2 C45.2 D2.K(CATHODE) R36.2 R38.2 R39.2 R40.2 R42.2 R90.2 U1.AA20(RFUSE) U1.AB19(VFS) U1.AD23(SUSPEND) U5.1(GND) U5.4(GND) U6.3(GND) U26.2(GND) U27.2(GND) U28.2(GND) U41.4(GND)
/PROGR: PROGB.1(In) R30.2 R31.2 U1.AF3(PROGRAM_B_2) ; port /PROGR
AWAKE: AWAKE.1(In) U1.AE23(IO_L74P_AWAKE_1)
CCLK: CCLK.1(In) R34.2 R90.1 U1.AD22(IO_L1P_CCLK_2) ; port CCLK
CMPCS_B: CMPCSB.1(In) U1.AC22(CMPCS_B_2)
CSI_B: R38.1 U1.AF20(IO_L3N_MOSI_CSI_B_MISO0_2)
D0: U1.AD20(IO_L3P_D0_DIN_MISO_MISO1_2)
D1: U1.AE17(IO_L12P_D1_MISO2_2)
D2: U1.AF17(IO_L12N_D2_MISO3_2)
D3: U1.AD10(IO_L49P_D3_2)
D4: U1.AF10(IO_L49N_D4_2)
D5: U1.AE7(IO_L62P_D5_2)
D6: U1.AF7(IO_L62N_D6_2)
D7: U1.AE9(IO_L48P_D7_2)
DONE: DONE.1(In) R32.2 U1.AF23(DONE_2) U41.2(A1) ; port DONE
DONE2: R35.1 U41.7(B1)
DONE_LED: D2.A(ANODE) R35.2
HSWAPEN: R40.1 U1.A3(IO_L1P_HSWAPEN_0)
INIT2: R41.1 U41.6(B2)
INIT_B: INIT.1(In) R33.2 U1.AE4(IO_L65P_INIT_B_2) U41.3(A2) ; port INIT_B
INIT_LED: D3.K(CATHODE) R41.2
M0: R36.1 U1.AF22(IO_L1N_M0_CMPMISO_2)
M1: R37.1 U1.AD16(IO_L13P_M1_2)
POR: R29.2 U5.2(~{RESET}) U6.2(A)
RDWR_B: R39.1 U1.AF9(IO_L48N_RDWR_B_VREF_2)
TCK_2V5: C47.1 U1.E21(TCK) U27.4(B) ; port TCK_2V5
TCK_Pr: TCK.1(In) U27.3(A) ; port TCK_Pr
TDI_2V5: U1.F20(TDI) U26.4(B)
TDI_Pr: TDI.1(In) U26.3(A) ; port TDI_Pr
TDO_FPGA: TDOF.1(In) U1.A24(TDO) ; port TDO_FPGA
TMS_2V5: U1.C23(TMS) U28.4(B) ; port TMS_2V5
TMS_Pr: TMS.1(In) U28.3(A) ; port TMS_Pr
NetC47_2: C47.2 R42.1
NetD8_A: D8.A(ANODE) R110.2
NetD8_K: D8.K(CATHODE) R30.1 U6.4(Y)

Not connected (* = marked no-connect by the designer): U6 1(NC)

### Buses and harness runs
bus D[7..0] = port D[7..0]

### Notes on the sheet
- Generate a hard reset when the power deviates >10% from 3.3V.
- (near R30) 0.0K enables POR
- Power-on Reset
- CCLK Routing Guidelines
- Hard Reset
- • Route the CCLK net as a 50Ω controlled impedance transmission line.
  • Always route the CCLK net without any branching; do not use a star topology.
  • Stubs, if necessary, must be shorter than 8 mm (0.3 inches).
  • Terminate the end of the CCLK transmission line with a parallel termination of 100Ω to VCCO and
  100Ω to GND (the Thevenin equivalent of VCCO/2, and assuming a trace characteristic impedance of
  50Ω).
  • After configuration in master mode, the CCLK pin is not driven unless it is used in the user
  design. If unused in the design, it is recommended to drive this pin to a logic level to prevent
  the pin from floating after configuration has completed.
- Data Bus
- LED Driver Bypassing
- 20MHz / 33 MHz / 40 MHz Configuration Clock
- Configure FPGA for Parallel Slave SelectMap
- CCLK
- M0=0 Parallel Mode
  M0=1 Serial   Mode
  M1=0 Master Mode
  M1=1 Slave  Mode
- RDWR_B and CSI_B pins are tied to ground for continuous data loading. c.f. UG380 p32
- (near R36) M0=0
- (near R37) M1=1
- (near R40) HSWAPEN=0.0K pulls up IOs
  HSWAPEN=10M  floats IOs
- (near U1) The SUSPEND pin must be Low during power-up. Connection of an external pull-down resistor ensures this condition.
- (near R42) Place near FPGA
- Date:
- Rev:
- of
- Sheet
- (in symbol C0402C104K4RACTU) .
- (in symbol SN74LVC1T45-EP-ALCT_1) H=A->B
- (in symbol XC6SLX100-3FGG676C, part G) VCCO

### Library data of the parts
AWAKE CCLK CMPCSB DONE INIT PROGB TCK TDI TDOF TMS = TPVIA: as GBT_PRG on sheet GBTx_IO; COMPROT: 0; Package: 90; mfgr_id: TPVIA; mfgr_foot: TPVIA
C43-C45 C47 = C0402C104K4RACTU: CAP CER 0.1UF 16V X7R 0402; Manufacturer: KEMET; Capacitance: 0.10µF; Tolerance: ±10%; Supplier 1: Digi-Key; Manufacturer Part Number: C0402C104K4RACTU; RoHS: RoHS Compliant; Category: Capacitors; Stock 1: 3565698; Pricing 1: 1=0.11, 10=0.078, 25=0.0568, 50=0.0442, 100=0.0365, 250=0.03024, 500=0.02562, 1000=0.02121, 5000=0.01806 (USD); Packaging: Cut Tape (CT); Part Status: Active; Operating Temperature: -55°C ~ 125°C; Features: -; Ratings: -; Applications: General Purpose; Failure Rate: -; Mounting Type: Surface Mount, MLCC; Package / Case: 0402 (1005 Metric); Size / Dimension: 0.039" L x 0.020" W (1.00mm x 0.50mm); Height - Seated (Max): -; Thickness (Max): 0.022" (0.55mm); Lead Spacing: -; Lead Style: -; ComponentLink1URL: http://www.kemet.com/docfinder?Partnumber=C0402C104K4RACTU; ComponentLink1Description: http://www.kemet.com/docfinder?Partnumber=C0402C104K4RACTU; Supplier 2: Digi-Key; Stock 2: 3565998; Pricing 2: 1=0.11, 10=0.078, 25=0.0568, 50=0.0442, 100=0.0365, 250=0.03024, 500=0.02562, 1000=0.02121, 5000=0.01806 (USD); Supplier Part Number 1: 399-3521-1-ND; Supplier Part Number 2: 399-3521-6-ND; Temperature Coefficient: X7R
D2 = LTST-C193TBKT-5A: LED BLUE CLEAR 0603 SMD; Manufacturer: Lite-On Inc.; Lens Color: Colorless; Millicandela Rating: 15mcd; Lens Style/Size: Rectangle with Flat Top, 1.15mm x 0.80mm; Viewing Angle: 130°; Wavelength - Dominant: 470nm; Wavelength - Peak: 468nm; Supplier 1: Digi-Key; Manufacturer Part Number: LTST-C193TBKT-5A; RoHS: RoHS Compliant; Category: Optoelectronics; Stock 1: 380419; Pricing 1: 1=0.47, 10=0.336, 25=0.2572, 100=0.1678, 250=0.12304, 500=0.10442, 1000=0.08577 (USD); Packaging: Cut Tape (CT); Part Status: Active; Color: Blue; Lens Transparency: Clear; Mounting Type: Surface Mount; Features: -; Package / Case: 0603 (1608 Metric); Size / Dimension: 1.60mm L x 0.80mm W; Height (Max): 0.35mm; ComponentLink1URL: http://optoelectronics.liteon.com/upload/download/DS22-2004-060/P_100_LTST-C193TBKT-5A.pdf; ComponentLink1Description: http://optoelectronics.liteon.com/upload/download/DS22-2004-060/P_100_LTST-C193TBKT-5A.pdf; Supplier 2: Digi-Key; Stock 2: 380419; Pricing 2: 1=0.47, 10=0.336, 25=0.2572, 100=0.1678, 250=0.12304, 500=0.10442, 1000=0.08577 (USD); Supplier Part Number 1: 160-1827-1-ND; Supplier Part Number 2: 160-1827-6-ND; ComponentLink2Description: http://media.digikey.com/pdf/Data%20Sheets/Lite-On%20PDFs/LTST-C193TBKT-5A.pdf; ComponentLink2URL: http://media.digikey.com/pdf/Data%20Sheets/Lite-On%20PDFs/LTST-C193TBKT-5A.pdf; Supplier Device Package: Chip LED
D3 = LTST-C193KRKT-5A: LED RED CLEAR 0603 SMD; Manufacturer: Lite-On Inc.; Current - Test: 5mA; Lens Color: Colorless; Lens Style/Size: Rectangle with Flat Top, 1.15mm x 0.80mm; Millicandela Rating: 26.05mcd; Viewing Angle: 130°; Voltage - Forward (Vf) (Typ): 2V; Wavelength - Dominant: 631nm; Wavelength - Peak: 639nm; Category: Optoelectronics; Color: Red; ComponentLink1Description: http://optoelectronics.liteon.com/upload/download/DS22-2005-077/LTST-C193KRKT-5A.PDF; ComponentLink1URL: http://optoelectronics.liteon.com/upload/download/DS22-2005-077/LTST-C193KRKT-5A.PDF; Features: -; Height (Max): 0.45mm; Lens Transparency: Clear; Manufacturer Part Number: LTST-C193KRKT-5A; Mounting Type: Surface Mount; Package / Case: 0603 (1608 Metric); Packaging: Cut Tape (CT); Part Status: Active; Pricing 1: 1=0.41, 10=0.296, 25=0.2268, 100=0.148, 250=0.10852, 500=0.0921, 1000=0.07565, 2500=0.06578 (USD); Pricing 2: 1=0.41, 10=0.296, 25=0.2268, 100=0.148, 250=0.10852, 500=0.0921, 1000=0.07565, 2500=0.06578 (USD); RoHS: RoHS Compliant; Size / Dimension: 1.60mm L x 0.80mm W; Stock 1: 97257; Stock 2: 97257; Supplier 1: Digi-Key; Supplier 2: Digi-Key; Supplier Device Package: Chip LED; Supplier Part Number 1: 160-1830-1-ND; Supplier Part Number 2: 160-1830-6-ND
D8 = LTST-C193KRKT-5A: LED RED CLEAR 0603 SMD; Manufacturer: Lite-On Inc.; Lens Color: Colorless; Millicandela Rating: 26.05mcd; Lens Style/Size: Rectangle with Flat Top, 1.15mm x 0.80mm; Voltage - Forward (Vf) (Typ): 2V; Current - Test: 5mA; Viewing Angle: 130°; Wavelength - Dominant: 631nm; Wavelength - Peak: 639nm; Supplier 1: Digi-Key; Manufacturer Part Number: LTST-C193KRKT-5A; RoHS: RoHS Compliant; Category: Optoelectronics; Stock 1: 97257; Pricing 1: 1=0.41, 10=0.296, 25=0.2268, 100=0.148, 250=0.10852, 500=0.0921, 1000=0.07565, 2500=0.06578 (USD); Packaging: Cut Tape (CT); Part Status: Active; Color: Red; Lens Transparency: Clear; Mounting Type: Surface Mount; Features: -; Package / Case: 0603 (1608 Metric); Supplier Device Package: Chip LED; Size / Dimension: 1.60mm L x 0.80mm W; Height (Max): 0.45mm; ComponentLink1URL: http://optoelectronics.liteon.com/upload/download/DS22-2005-077/LTST-C193KRKT-5A.PDF; ComponentLink1Description: http://optoelectronics.liteon.com/upload/download/DS22-2005-077/LTST-C193KRKT-5A.PDF; Supplier 2: Digi-Key; Stock 2: 97257; Pricing 2: 1=0.41, 10=0.296, 25=0.2268, 100=0.148, 250=0.10852, 500=0.0921, 1000=0.07565, 2500=0.06578 (USD); Supplier Part Number 1: 160-1830-1-ND; Supplier Part Number 2: 160-1830-6-ND
R29 R31 R33 = CR0603-FX-4701ELF: as R44-R50 on sheet Source_Select; Supplier 1: Digi-Key; Manufacturer Part Number: CR0603-FX-4701ELF; RoHS: RoHS Compliant; Category: Resistors; Stock 1: 43560; Pricing 1: 1=0.1, 10=0.021, 100=0.0086, 1000=0.00385, 2500=0.00334 (USD); Packaging: Cut Tape (CT); Part Status: Active; Resistance (Ohms): 4.7k; Composition: Thick Film; Features: Moisture Resistant; Operating Temperature: -55°C ~ 155°C; Package / Case: 0603 (1608 Metric); Size / Dimension: 0.063" L x 0.031" W (1.60mm x 0.80mm); Height - Seated (Max): 0.022" (0.55mm); Failure Rate: -; ComponentLink1URL: http://www.bourns.com/docs/Product-Datasheets/CHPREZTR.pdf; ComponentLink1Description: http://www.bourns.com/docs/Product-Datasheets/CHPREZTR.pdf; Supplier 2: Digi-Key; Stock 2: 43560; Pricing 2: 1=0.1, 10=0.021, 100=0.0086, 1000=0.00385, 2500=0.00334 (USD); Supplier Part Number 1: CR0603-FX-4701ELFCT-ND; Supplier Part Number 2: CR0603-FX-4701ELFDKR-ND; Tolerance: ±1%
R30 = RES999G 0603: RES SMD 999G OHM 5% 1/10W 0603; Manufacturer Part Number: Do Not Place
R32 = CR0603-FX-3300ELF: RES SMD 330 OHM 1% 1/10W 0603; Manufacturer: Bourns Inc.; Resistance (Ohms): 330; Power (Watts): 0.1W, 1/10W; Temperature Coefficient: ±100ppm/°C; Tolerance: ±1%; Supplier 1: Digi-Key; Manufacturer Part Number: CR0603-FX-3300ELF; RoHS: RoHS Compliant; Category: Resistors; Stock 1: 45245; Pricing 1: 1=0.1, 10=0.023, 100=0.0092, 1000=0.00414, 2500=0.00359 (USD); Packaging: Cut Tape (CT); Part Status: Active; Composition: Thick Film; Features: Moisture Resistant; Operating Temperature: -55°C ~ 155°C; Package / Case: 0603 (1608 Metric); Size / Dimension: 0.063" L x 0.031" W (1.60mm x 0.80mm); Height - Seated (Max): 0.022" (0.55mm); Failure Rate: -; ComponentLink1URL: http://www.bourns.com/docs/Product-Datasheets/CHPREZTR.pdf; ComponentLink1Description: http://www.bourns.com/docs/Product-Datasheets/CHPREZTR.pdf; Supplier 2: Digi-Key; Stock 2: 45245; Pricing 2: 1=0.1, 10=0.023, 100=0.0092, 1000=0.00414, 2500=0.00359 (USD); Supplier Part Number 1: CR0603-FX-3300ELFCT-ND; Supplier Part Number 2: CR0603-FX-3300ELFDKR-ND
R34 R90 = ERJ-2RKF1100X: RES SMD 110 OHM 1% 1/10W 0402; Manufacturer: Panasonic Electronic Components; Power (Watts): 0.1W, 1/10W; Temperature Coefficient: ±100ppm/°C; Supplier 1: Digi-Key; Manufacturer Part Number: ERJ-2RKF1100X; RoHS: RoHS Compliant; Category: Resistors; Stock 1: 171366; Pricing 1: 1=0.1, 10=0.039, 100=0.016, 1000=0.00719, 2500=0.00624, 5000=0.00515 (USD); Packaging: Cut Tape (CT); Part Status: Active; Composition: Thick Film; Features: Automotive AEC-Q200; Operating Temperature: -55°C ~ 155°C; Package / Case: 0402 (1005 Metric); Size / Dimension: 0.039" L x 0.020" W (1.00mm x 0.50mm); Height - Seated (Max): 0.016" (0.40mm); Failure Rate: -; ComponentLink1URL: https://industrial.panasonic.com/cdbs/www-data/pdf/RDA0000/AOA0000C304.pdf; ComponentLink1Description: https://industrial.panasonic.com/cdbs/www-data/pdf/RDA0000/AOA0000C304.pdf; Supplier 2: Digi-Key; Stock 2: 171366; Pricing 2: 1=0.1, 10=0.039, 100=0.016, 1000=0.00719, 2500=0.00624, 5000=0.00515 (USD); Supplier Part Number 1: P110LCT-ND; Supplier Part Number 2: P110LDKR-ND; Tolerance: ±1%
R35 R41 R110 = CR0603-FX-5100ELF: as R100 on sheet GBTx_IO; Tolerance: ±1%; Supplier 1: Digi-Key; Manufacturer Part Number: CR0603-FX-5100ELF; RoHS: RoHS Compliant; Category: Resistors; Stock 1: 523; Pricing 1: 1=0.1, 10=0.021, 100=0.0086, 1000=0.00385, 2500=0.00334 (USD); Packaging: Digi-Reel®; Part Status: Active; Composition: Thick Film; Features: Moisture Resistant; Operating Temperature: -55°C ~ 155°C; Package / Case: 0603 (1608 Metric); Size / Dimension: 0.063" L x 0.032" W (1.60mm x 0.80mm); Height - Seated (Max): 0.022" (0.55mm); Failure Rate: -; ComponentLink1URL: https://www.bourns.com/docs/Product-Datasheets/CHPREZTR.pdf; ComponentLink1Description: https://www.bourns.com/docs/Product-Datasheets/CHPREZTR.pdf; Supplier Part Number 1: CR0603-FX-5100ELFDKR-ND
R36-R39 = ERJ-2GE0R00X: RES SMD 0.0OHM JUMPER 1/10W 0402; Manufacturer: Panasonic Electronic Components; Resistance (Ohms): 0.0; Power (Watts): 0.1W, 1/10W; Tolerance: Jumper; Supplier 1: Digi-Key; Manufacturer Part Number: ERJ-2GE0R00X; RoHS: RoHS Compliant; Category: Resistors; Stock 1: 3132025; Pricing 1: 1=0.1, 50=0.0138, 100=0.0105, 250=0.0078, 500=0.00576, 1000=0.00384, 5000=0.0027 (USD); Packaging: Cut Tape (CT); Part Status: Active; Composition: Thick Film; Features: Automotive AEC-Q200; Temperature Coefficient: -; Operating Temperature: -55°C ~ 155°C; Package / Case: 0402 (1005 Metric); Size / Dimension: 0.039" L x 0.020" W (1.00mm x 0.50mm); Height - Seated (Max): 0.016" (0.40mm); Failure Rate: -; ComponentLink1URL: http://industrial.panasonic.com/www-cgi/jvcr13pz.cgi?E+PZ+3+AOA0001+ERJ2GE0R00X+7+WW; ComponentLink1Description: http://industrial.panasonic.com/www-cgi/jvcr13pz.cgi?E+PZ+3+AOA0001+ERJ2GE0R00X+7+WW; Supplier 2: Digi-Key; Stock 2: 3132025; Pricing 2: 1=0.1, 50=0.0138, 100=0.0105, 250=0.0078, 500=0.00576, 1000=0.00384, 5000=0.0027 (USD); Supplier Part Number 1: P0.0JCT-ND; Supplier Part Number 2: P0.0JDKR-ND; Number of Terminations: 2
R40 = ERJ-2GEJ106X: RES SMD 10M OHM 5% 1/10W 0402; Manufacturer: Panasonic Electronic Components; Power (Watts): 0.1W, 1/10W; Temperature Coefficient: -400/ +150ppm/°C; Tolerance: ±5%; Supplier 1: Digi-Key; Manufacturer Part Number: ERJ-2GEJ106X; RoHS: RoHS Compliant; Category: Resistors; Stock 1: 53777; Pricing 1: 1=0.1, 50=0.0106, 100=0.0078, 250=0.00596, 500=0.00476, 1000=0.0035, 5000=0.00251 (USD); Packaging: Cut Tape (CT); Part Status: Active; Resistance (Ohms): 10M; Composition: Thick Film; Features: Automotive AEC-Q200; Operating Temperature: -55°C ~ 155°C; Package / Case: 0402 (1005 Metric); Size / Dimension: 0.039" L x 0.020" W (1.00mm x 0.50mm); Height - Seated (Max): 0.016" (0.40mm); Number of Terminations: 2; Failure Rate: -; ComponentLink1URL: http://industrial.panasonic.com/www-cgi/jvcr13pz.cgi?E+PZ+3+AOA0001+ERJ2GEJ106X+7+WW; ComponentLink1Description: http://industrial.panasonic.com/www-cgi/jvcr13pz.cgi?E+PZ+3+AOA0001+ERJ2GEJ106X+7+WW; Supplier 2: Digi-Key; Stock 2: 53777; Pricing 2: 1=0.1, 50=0.0106, 100=0.0078, 250=0.00596, 500=0.00476, 1000=0.0035, 5000=0.00251 (USD); Supplier Part Number 1: P10MJCT-ND; Supplier Part Number 2: P10MJDKR-ND
R42 = ERJ-2GEJ750X: RES SMD 75 OHM 5% 1/10W 0402; Manufacturer: Panasonic Electronic Components; Power (Watts): 0.1W, 1/10W; Temperature Coefficient: ±200ppm/°C; Tolerance: ±5%; Supplier 1: Digi-Key; Manufacturer Part Number: ERJ-2GEJ750X; RoHS: RoHS Compliant; Category: Resistors; Stock 1: 127750; Pricing 1: 1=0.1, 10=0.02, 100=0.008, 1000=0.00359, 2500=0.00312, 5000=0.00258 (USD); Packaging: Cut Tape (CT); Part Status: Active; Composition: Thick Film; Features: Automotive AEC-Q200; Operating Temperature: -55°C ~ 155°C; Package / Case: 0402 (1005 Metric); Size / Dimension: 0.039" L x 0.020" W (1.00mm x 0.50mm); Height - Seated (Max): 0.016" (0.40mm); Failure Rate: -; ComponentLink1URL: http://industrial.panasonic.com/www-cgi/jvcr13pz.cgi?E+PZ+3+AOA0001+ERJ2GEJ750X+7+WW; ComponentLink1Description: http://industrial.panasonic.com/www-cgi/jvcr13pz.cgi?E+PZ+3+AOA0001+ERJ2GEJ750X+7+WW; Supplier 2: Digi-Key; Stock 2: 127750; Pricing 2: 1=0.1, 10=0.02, 100=0.008, 1000=0.00359, 2500=0.00312, 5000=0.00258 (USD); Supplier Part Number 1: P75JCT-ND; Supplier Part Number 2: P75JDKR-ND
U1 = XC6SLX100-3FGG676C: Manufacturer: Xilinx Inc.; Voltage - Supply: 1.14 V ~ 1.26 V; Supplier 1: Digi-Key; Manufacturer Part Number: XC6SLX100-3FGG676C; RoHS: RoHS Compliant; Category: Integrated Circuits (ICs); Stock 1: 275; Pricing 1: 1=145.6 (USD); Part Status: Active; Mounting Type: Surface Mount; Operating Temperature: 0°C ~ 85°C (TJ); Package / Case: 676-BGA; Supplier Device Package: 676-FBGA (27x27); ComponentLink1URL: http://www.xilinx.com/support/documentation/data_sheets/ds162.pdf; ComponentLink1Description: http://www.xilinx.com/support/documentation/data_sheets/ds162.pdf; Supplier Part Number 1: 122-1760-ND
U5 = DS1233AZ-10+: IC POR 2.88V 10% SOT223; Manufacturer: Maxim Integrated; Manufacturer Part Number: DS1233AZ-10+T&R; Output: Open Drain or Open Collector; Reset: Active Low; Reset Timeout: 250 ms Minimum; Supplier 1: Digi-Key; RoHS: RoHS Compliant; Category: Integrated Circuits (ICs); Stock 1: 3429; Pricing 1: 1=2.14, 10=2.015, 25=1.6116, 50=1.531, 100=1.4102, 250=1.33764, 500=1.28928 (USD); Packaging: Cut Tape (CT); Part Status: Active; Type: Simple Reset/Power-On Reset; Voltage - Threshold: 2.88V; Operating Temperature: -40°C ~ 85°C (TA); Mounting Type: Surface Mount; Package / Case: TO-261-4, TO-261AA; Supplier Device Package: SOT-223-3; ComponentLink1URL: http://datasheets.maximintegrated.com/en/ds/DS1233A.pdf; ComponentLink1Description: http://datasheets.maximintegrated.com/en/ds/DS1233A.pdf; Supplier 2: Digi-Key; Stock 2: 2849; Pricing 2: 1=2.55, 10=2.423, 25=1.7, 50=1.615, 100=1.26, 250=1.197 (USD); Supplier 3: Digi-Key; Stock 3: 3429; Pricing 3: 1=2.14, 10=2.015, 25=1.6116, 50=1.531, 100=1.4102, 250=1.33764, 500=1.28928 (USD); Supplier Part Number 1: DS1233AZ-10+CT-ND; Supplier Part Number 2: DS1233AZ-10+-ND; Supplier Part Number 3: DS1233AZ-10+DKR-ND
U6 = SN74LVC1G07-EP: as U24 on sheet GBTx_IO; Package: 99; Supplier 1: Digi-Key; Manufacturer Part Number: SN74LVC1G07MDCKREP; RoHS: RoHS Compliant; Category: Integrated Circuits (ICs); Stock 1: 4252; Pricing 1: 1=0.81, 10=0.714, 100=0.5472, 500=0.4326, 1000=0.34608 (USD); Packaging: Cut Tape (CT); Part Status: Active; Input Type: -; Output Type: Open Drain; Operating Temperature: -55°C ~ 125°C (TA); Mounting Type: Surface Mount; Package / Case: 5-TSSOP, SC-70-5, SOT-353; Supplier Device Package: SC-70-5; ComponentLink1URL: http://www.ti.com/lit/ds/symlink/sn74lvc1g07-ep.pdf; ComponentLink1Description: http://www.ti.com/lit/ds/symlink/sn74lvc1g07-ep.pdf; Supplier 2: Digi-Key; Stock 2: 4252; Pricing 2: 1=0.81, 10=0.714, 100=0.5472, 500=0.4326, 1000=0.34608 (USD); Supplier Part Number 1: 296-22343-1-ND; Supplier Part Number 2: 296-22343-6-ND
U26-U28 = SN74LVC1T45-EP-ALCT_1: IC BUS TRANSCVR TRI-ST SC70-6; Manufacturer: Texas Instruments; COMPSIDE: TOP; COMPGROUP: 0; COMPROT: 270; mfgr_id: SN74LVC1T45MDCKREP; mfgr: Texas Inst; mfgr_foot: DCK; Translator Type: Voltage Level; Channel Type: Bidirectional; Channels per Circuit: 1; Output Type: Tri-State, Non-Inverted; Data Rate: 420Mbps; Supplier 1: Digi-Key; Manufacturer Part Number: SN74LVC1T45DCKR; RoHS: RoHS Compliant; Category: Integrated Circuits (ICs); Stock 1: 91787; Pricing 1: 1=0.58, 10=0.494, 100=0.3692, 500=0.29004, 1000=0.22413 (USD); Packaging: Cut Tape (CT); Part Status: Active; Input Signal: -; Output Signal: -; Operating Temperature: -40°C ~ 85°C (TA); Features: -; Mounting Type: Surface Mount; Package / Case: 6-TSSOP, SC-88, SOT-363; Supplier Device Package: SC-70-6; ComponentLink1URL: http://www.ti.com/lit/ds/symlink/sn74lvc1t45.pdf; ComponentLink1Description: http://www.ti.com/lit/ds/symlink/sn74lvc1t45.pdf; Supplier 2: Digi-Key; Stock 2: 91787; Pricing 2: 1=0.58, 10=0.494, 100=0.3692, 500=0.29004, 1000=0.22413 (USD); Supplier Part Number 1: 296-16844-1-ND; Supplier Part Number 2: 296-16844-6-ND
U41 = 74LVC2T45DC,125: IC TRNSLTR BIDIRECTIONAL 8VSSOP; Manufacturer: Nexperia USA Inc.; Translator Type: Voltage Level; Channels per Circuit: 2; Output Type: Tri-State, Non-Inverted; Data Rate: 420Mbps; Propagation Delay: 48.6ns; Min Supply Voltage: 1.2V; Max Supply Voltage: 5.5V; Max Power Dissipation: 250mW; Number of Elements: 1; Logic Function: Transceiver,Translator; Turn-On Delay Time: 15.2ns; High Level Output Current: -32mA; Low Level Output Current: 32mA; Quiescent Current: 8uA; Polarity: Non-Inverting; Supplier 1: Digi-Key; Manufacturer Part Number: 74LVC2T45DC,125; RoHS: RoHS Compliant; Category: Integrated Circuits (ICs); Stock 1: 0; Pricing 1: 1=0.58, 10=0.51, 100=0.3909, 500=0.309, 1000=0.2472 (USD); Packaging: Digi-Reel®; Part Status: Active; Channel Type: Bidirectional; Input Signal: -; Output Signal: -; Operating Temperature: -40°C ~ 125°C (TA); Features: -; Mounting Type: Surface Mount; Package / Case: 8-VFSOP (0.091", 2.30mm Width); Supplier Device Package: 8-VSSOP; Base Part Number: 74LVC2T45; ComponentLink1URL: https://assets.nexperia.com/documents/data-sheet/74LVC_LVCH2T45.pdf; ComponentLink1Description: https://assets.nexperia.com/documents/data-sheet/74LVC_LVCH2T45.pdf; Supplier Part Number 1: 1727-4578-6-ND; Mount: Surface Mount; Case/Package: VSSOP; Number of Pins: 8; Contact Plating: Gold; Min Operating Temperature: -40°C; Max Operating Temperature: 125°C; Number of Channels: 2; Package Quantity: 3000; Direction: Bidirectional; Number of Bits: 2; Radiation Hardening: No; REACH SVHC: No SVHC; Lead Free: Lead Free; ComponentLink2URL: https://datasheet.ciiva.com/1900/74lvc-lvch2t45-1900049.pdf; ComponentLink2Description: https://datasheet.ciiva.com/1900/74lvc-lvch2t45-1900049.pdf; ComponentLink3URL: https://datasheet.ciiva.com/1900/74lvc-lvch2t45-1900050.pdf; ComponentLink3Description: https://datasheet.ciiva.com/1900/74lvc-lvch2t45-1900050.pdf; ComponentLink4URL: https://datasheet.ciiva.com/1900/74lvc-lvch2t45-1900051.pdf; ComponentLink4Description: https://datasheet.ciiva.com/1900/74lvc-lvch2t45-1900051.pdf; ComponentLink5URL: https://datasheet.ciiva.com/16406/74lvc-lvch2t45-16406598.pdf; ComponentLink5Description: https://datasheet.ciiva.com/16406/74lvc-lvch2t45-16406598.pdf; ComponentLink6URL: https://datasheet.ciiva.com/4798/74lvc-lvch2t45-4798887.pdf; ComponentLink6Description: https://datasheet.ciiva.com/4798/74lvc-lvch2t45-4798887.pdf; ComponentLink7URL: https://datasheet.ciiva.com/16591/74lvc-lvch2t45-16591338.pdf; ComponentLink7Description: https://datasheet.ciiva.com/16591/74lvc-lvch2t45-16591338.pdf; ComponentLink8URL: https://datasheet.ciiva.com/15086/getdatasheetpartid-422533-15086781.pdf; ComponentLink8Description: https://datasheet.ciiva.com/15086/getdatasheetpartid-422533-15086781.pdf